# EAGLE design BadUSB-W (EAGLE 9.3.0)

## Sheet 1 of 2
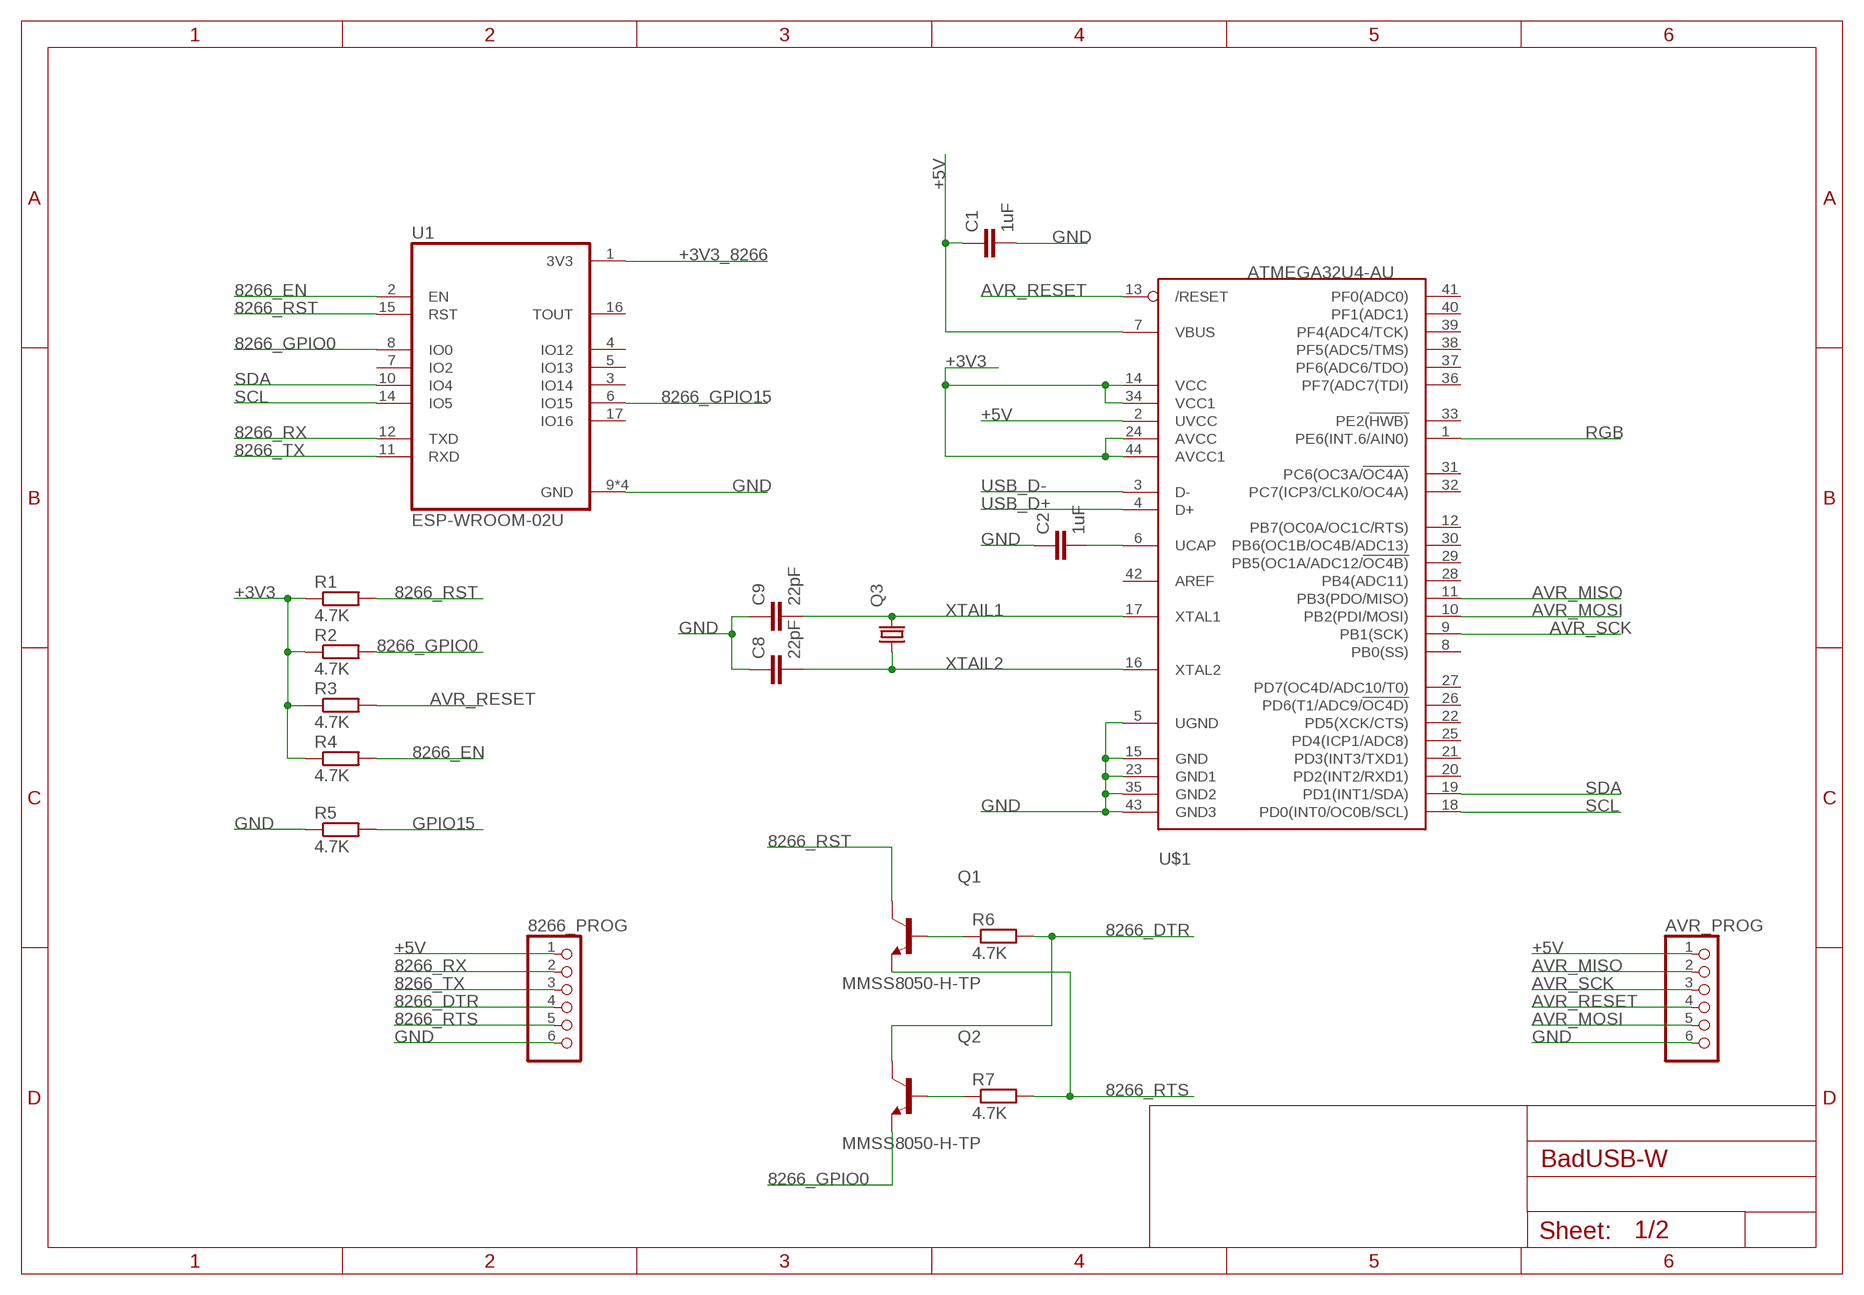
[diagram p0: schematic, sheet 1]

### Parts
8266_PROG  PINHD-1X6  [1X06]
AVR_PROG  PINHD-1X6  [1X06]
C1  1uF  C-EUC0603K  [C0603K]
C2  1uF  C-EUC0603K  [C0603K]
C8  22pF  C-EUC0603K  [C0603K]
C9  22pF  C-EUC0603K  [C0603K]
Q1  MMSS8050-H-TP  [TRANS_MMSS8050-H-TP]
Q2  MMSS8050-H-TP  [TRANS_MMSS8050-H-TP]
Q3  KX-7  [3.2X2.5_KX-7]
R1  4.7K  R-EU_R0603  [R0603]
R2  4.7K  R-EU_R0603  [R0603]
R3  4.7K  R-EU_R0603  [R0603]
R4  4.7K  R-EU_R0603  [R0603]
R5  4.7K  R-EU_R0603  [R0603]
R6  4.7K  R-EU_R0603  [R0603]
R7  4.7K  R-EU_R0603  [R0603]
U1  ESP-WROOM-02U  [MODULE_ESP-WROOM-02U]
U$1  ATMEGA32U4-AU  [TQFP44]

### Nets
8266_DTR: 8266_PROG.4 Q2.3(C) R6.2
8266_EN: R4.2 U1.2(EN)
8266_GPIO0: Q2.2(E) R2.2 U1.8(IO0)
8266_GPIO15: U1.6(IO15)
8266_RST: Q1.3(C) R1.2 U1.15(RST)
8266_RTS: 8266_PROG.5 Q1.2(E) R7.2
8266_RX: 8266_PROG.2 U1.12(TXD)
8266_TX: 8266_PROG.3 U1.11(RXD)
+3V3: R1.1 R2.1 R3.1 R4.1 U$1.14(VCC) U$1.24(AVCC) U$1.34(VCC1) U$1.44(AVCC1) ; also sheet 2
+3V3_8266: U1.1(3V3)
+5V: 8266_PROG.1 AVR_PROG.1 C1.1 U$1.2(UVCC) U$1.7(VBUS) ; also sheet 2
AVR_MISO: AVR_PROG.2 U$1.11(PB3(PDO/MISO))
AVR_MOSI: AVR_PROG.5 U$1.10(PB2(PDI/MOSI))
AVR_RESET: AVR_PROG.4 R3.2 U$1.13(/RESET)
AVR_SCK: AVR_PROG.3 U$1.9(PB1(SCK))
GND: 8266_PROG.6 AVR_PROG.6 C1.2 C2.1 C8.1 C9.1 R5.1 U1.9(GND) U1.13(GND) U1.18(GND) U1.19(GND) U$1.5(UGND) U$1.15(GND) U$1.23(GND1) U$1.35(GND2) U$1.43(GND3) ; also sheet 2
GPIO15: R5.2
N$1: C2.2 U$1.6(UCAP)
N$2: Q1.1(B) R6.1
N$3: Q2.1(B) R7.1
RGB: U$1.1(PE6(INT.6/AIN0)) ; also sheet 2
SCL: U1.14(IO5) U$1.18(PD0(INT0/OC0B/SCL))
SDA: U1.10(IO4) U$1.19(PD1(INT1/SDA))
USB_D+: U$1.4(D+) ; also sheet 2
USB_D-: U$1.3(D-) ; also sheet 2
XTAIL1: C9.2 Q3.3 U$1.17(XTAL1)
XTAIL2: C8.2 Q3.1 U$1.16(XTAL2)
Unconnected: U1.3(IO14) U1.4(IO12) U1.5(IO13) U1.7(IO2) U1.16(TOUT) U1.17(IO16) U$1.8(PB0(SS)) U$1.12(PB7(OC0A/OC1C/RTS)) U$1.20(PD2(INT2/RXD1)) U$1.21(PD3(INT3/TXD1)) U$1.22(PD5(XCK/CTS)) U$1.25(PD4(ICP1/ADC8)) U$1.26(PD6(T1/ADC9/!OC4D)) U$1.27(PD7(OC4D/ADC10/T0)) U$1.28(PB4(ADC11)) U$1.29(PB5(OC1A/ADC12/!OC4B)) U$1.30(PB6(OC1B/OC4B/ADC13)) U$1.31(PC6(OC3A/!OC4A)) U$1.32(PC7(ICP3/CLK0/OC4A)) U$1.33(PE2(!HWB)) U$1.36(PF7(ADC7(TDI)) U$1.37(PF6(ADC6/TDO)) U$1.38(PF5(ADC5/TMS)) U$1.39(PF4(ADC4/TCK)) U$1.40(PF1(ADC1)) U$1.41(PF0(ADC0)) U$1.42(AREF)

## Sheet 2 of 2
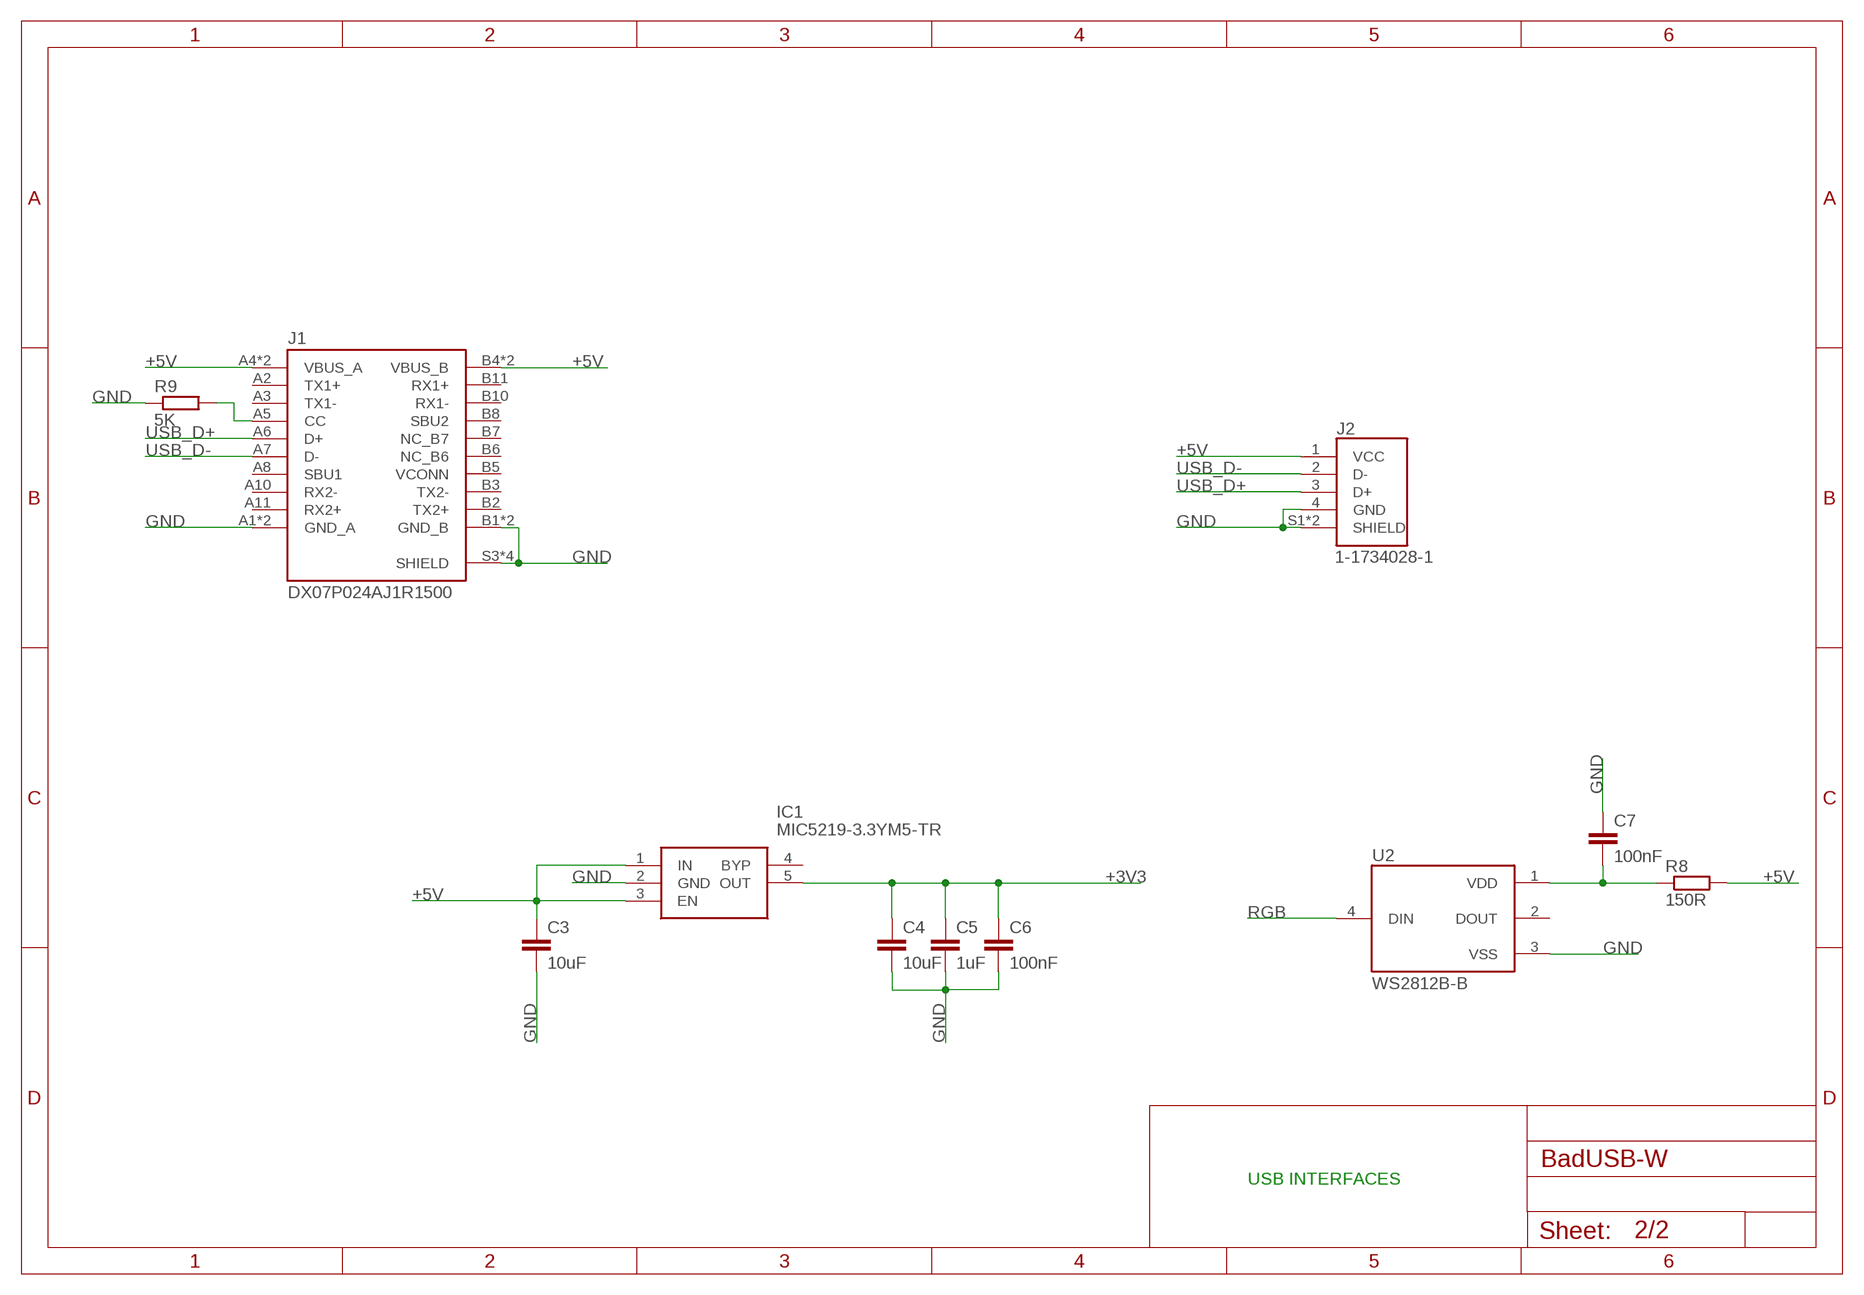
[diagram p1: schematic, sheet 2]

### Parts
C3  10uF  C-EUC0603K  [C0603K]
C4  10uF  C-EUC0603K  [C0603K]
C5  1uF  C-EUC0603K  [C0603K]
C6  100nF  C-EUC0603K  [C0603K]
C7  100nF  C-EUC0603K  [C0603K]
IC1  MIC5219-3.3YM5-TR  [SOT95P280X130-5N]
J1  DX07P024AJ1R1500  [JAE_DX07P024AJ1R1500]
J2  1-1734028-1  [TE_1-1734028-1]
R8  150R  R-EU_R0603  [R0603]
R9  5K  R-EU_R0603  [R0603]
U2  WS2812B-B  [LED_WS2812B-B]

### Nets
+3V3: C4.1 C5.1 C6.1 IC1.5(OUT) ; also sheet 1
+5V: C3.1 IC1.1(IN) IC1.3(EN) J1.A4(VBUS_A) J1.A9(VBUS_A) J1.B4(VBUS_B) J1.B9(VBUS_B) J2.1(VCC) R8.2 ; also sheet 1
GND: C3.2 C4.2 C5.2 C6.2 C7.1 IC1.2(GND) J1.A1(GND_A) J1.A12(GND_A) J1.B1(GND_B) J1.B12(GND_B) J1.S3(SHIELD) J1.S4(SHIELD) J1.S5(SHIELD) J1.S6(SHIELD) J2.4(GND) J2.S1(SHIELD) J2.S2(SHIELD) R9.1 U2.3(VSS) ; also sheet 1
N$4: C7.2 R8.1 U2.1(VDD)
N$5: J1.A5(CC) R9.2
RGB: U2.4(DIN) ; also sheet 1
USB_D+: J1.A6(D+) J2.3(D+) ; also sheet 1
USB_D-: J1.A7(D-) J2.2(D-) ; also sheet 1
Unconnected: IC1.4(BYP) J1.A2(TX1+) J1.A3(TX1-) J1.A8(SBU1) J1.A10(RX2-) J1.A11(RX2+) J1.B2(TX2+) J1.B3(TX2-) J1.B5(VCONN) J1.B6(NC_B6) J1.B7(NC_B7) J1.B8(SBU2) J1.B10(RX1-) J1.B11(RX1+) U2.2(DOUT)

### Notes on the sheet
- USB INTERFACES

## Library data of the parts
8266_PROG AVR_PROG = adafruit:PINHD-1X6: PIN HEADER
C1-C9 = rcl:C-EU: CAPACITOR, European symbol; SPICEPREFIX: C
IC1 = MIC5219-3.3YM5-TR:MIC5219-3.3YM5-TR: LDO Regulator Pos 3.3V 0.5A Microchip MIC5219-3.3YM5-TR, LDO Voltage Regulator, 500mA, 3.3 V +/-2%, 2.5 12 Vin, 5-Pin SOT-23 Source: Datasheet <http://www.microchip.com/mymicrochip/filehandler.aspx?ddocname=en579712>; ARROW_PART_NUMBER: MIC5219-3.3YM5-TR; ARROW_PRICE-STOCK: https://www.arrow.com/en/products/mic5219-3.3ym5-tr/microchip-technology; DESCRIPTION: LDO Regulator Pos 3.3V 0.5A Microchip MIC5219-3.3YM5-TR, LDO Voltage Regulator, 500mA, 3.3 V +/-2%, 2.5 12 Vin, 5-Pin SOT-23; HEIGHT: 1.3mm; MANUFACTURER_NAME: Microchip; MANUFACTURER_PART_NUMBER: MIC5219-3.3YM5-TR; MOUSER_PART_NUMBER: 998-MIC5219-3.3YM5TR; MOUSER_PRICE-STOCK: https://www.mouser.co.uk/ProductDetail/Microchip-Technology-Micrel/MIC5219-33YM5-TR/?qs=U6T8BxXiZAWojkIJMtSJlw%3D%3D
J1 = DX07P024AJ1R1500:DX07P024AJ1R1500: USB-C (USB TYPE-C) USB 3.2 Gen 2 (USB 3.1 Gen 2, Superspeed + (USB 3.1)) Plug Connector 24 Position Board Edge, Straddle Mount Check prices <https://pricing.snapeda.com/parts/DX07P024AJ1R1500/JAE%20Electronics/view-part?ref=eda>; AVAILABILITY: In Stock; DESCRIPTION: USB-C (USB TYPE-C) USB 3.2 Gen 2 (USB 3.1 Gen 2, Superspeed + (USB 3.1)) Plug Connector 24 Position Board Edge, Straddle Mount; MF: JAE Electronics; MP: DX07P024AJ1R1500; PACKAGE: None; PRICE: None
J2 = 1-1734028-1:1-1734028-1: Conn USB 2.0 Type A PL 4 POS Solder RA SMD 4 Terminal 1 Port T/R Check prices <https://pricing.snapeda.com/parts/1-1734028-1/TE%20Connectivity/view-part?ref=eda>; AVAILABILITY: In Stock; COMMENT: 1-1734028-1; DESCRIPTION: Conn USB 2.0 Type A PL 4 POS Solder RA SMD 4 Terminal 1 Port T/R; MF: TE Connectivity; MP: 1-1734028-1; PACKAGE: None; PRICE: None
Q1 Q2 = MMSS8050-H-TP:MMSS8050-H-TP: MMSS8050-H Series 25 V 1.5 A NPN Silicon Plastic-Encapsulate Transistor-SOT-23 Check prices <https://pricing.snapeda.com/parts/MMSS8050-H-TP/Micro%20Commercial/view-part?ref=eda>; AVAILABILITY: In Stock; DESCRIPTION: Bipolar (BJT) Transistor NPN 25V 1.5A 100MHz 625mW Surface Mount SOT-23; MF: Micro Commercial; MP: MMSS8050-H-TP; PACKAGE: SOT-23 MCC; PRICE: None
Q3 = crystal-geyer_V1_0:KX: Quartz Crystals (MHz) SMD: KX - Serie Model Size l/w/h [mm] Frequency Range Frequency Stability Temp. Range [°C] Load Capacitance AECQ 200 availabel Datasheet KX-4 KX-5 KX-6 KX-7 KX-9A KX-9B KX-12A KX-12B KX-13 KX-20 KX-K KX-KS 1.6/1.2/0.3 2.0/1.6/0.45 2.5/2.0/0.55 3.2/2.5/0.8 5.0/3.2/1.0 5.0/3.2/1.1 6.0/3.5/1.1 6.0/3.5/1.0 7.0/5.0 /1.3 11.6/5.5/1.6 12.3/4.5/4.2 12.3/4.5/3.2 24.0 ~ 80.0 MHz 16.0 ~ 80.0 MHz 12.0 ~ 80.0 MHz 8.0 ~ 60.0 MHz 7,68 ~ 300,0 MHz 8,0 ~ 50,0 MHz 8,0 ~ 150,0 MHz 8,0 ~ 50,0 MHz 6,0 ~ 160,0 MHz 3,579 ~ 25,0 MHz 3,579 ~ 70,0 MHz 3,579 ~ 70,0 MHz ±10 … ±50ppm ±10 … ±50ppm ±10 … ±50ppm ±10 … ±50ppm ±10 … ±50ppm ±10 … ±50ppm ±10 … ±50ppm ±10 … ±50ppm ±10 … ±50ppm ±50ppm ±10 … ±50ppm ±10 … ±50ppm (*) -40°C …+85°C (*) -40°C …+125°C (*) -40°C …+125°C (*) -40°C …+125°C (*) -40°C …+105°C (*) -40°C …+105°C (*) -40°C …+125°C (*) -40°C …+105°C (*) -40°C …+105°C (*) -40°C …+105°C (*) -40°C …+85°C (*) -40°C …+85°C 8, 8…16 8, 8…16 10, 8…16 12, 7…20 16, 10…20 16, 10…20 16, 10…20 16, 12…20 16, 12…20 16, 12…20 16, 12…30 16, 12…30 - yes yes yes - - - - - - - - KX-4.pdf <http://www.geyer-electronic.de/uploads/tx_userartikelfrequenz/GEYER-KX-4.pdf> KX-5.pdf <http://www.geyer-electronic.de/uploads/tx_userartikelfrequenz/GEYER-KX-5.pdf> KX-6.pdf <http://www.geyer-electronic.de/uploads/tx_userartikelfrequenz/GEYER-KX-6.pdf> KX-7.pdf <http://www.geyer-electronic.de/uploads/tx_userartikelfrequenz/GEYER-KX-7.pdf> KX-9A.pdf <http://www.geyer-electronic.de/uploads/tx_userartikelfrequenz/GEYER-KX-9A.pdf> KX-9B.pdf <http://www.geyer-electronic.de/uploads/tx_userartikelfrequenz/GEYER-KX-9B.pdf> KX-12A.pdf <http://www.geyer-electronic.de/uploads/tx_userartikelfrequenz/GEYER-KX-12A.pdf> KX-12B.pdf <http://www.geyer-electronic.de/uploads/tx_userartikelfrequenz/GEYER-KX-12B.pdf> KX-13.pdf <http://www.geyer-electronic.de/uploads/tx_userartikelfrequenz/GEYER-KX-13.pdf> KX-20.pdf <http://www.geyer-electronic.de/uploads/tx_userartikelfrequenz/GEYER-KX-20.pdf> KX-K.pdf <http://www.geyer-electronic.de/uploads/tx_userartikelfrequenz/GEYER-KX-K.pdf> KX-KS.pdf <http://www.geyer-electronic.de/uploads/tx_userartikelfrequenz/GEYER-KX-KS.pdf> <http://www.geyer-electronic.de/fileadmin/template/img/logo-geyer-electronic.png> Details see: http://www.geyer-electronic.de/Frequenz-Produkte.9.0.html Created 2016-06-07, Hans Locher 2016 (C) Geyer Quartz Technology KX4,KX5,KX6,KX7,KX9A,KX9B,KX12A,KX12B,KX13,KX20,KXK,KXKS;1612;2016;2520;3225;5032;6035;7050;11655;12345;1,6x1,2;2,0x1,6;2,5x2,0;3,2x2,5;5,0x3,2;6,0x3,5;7,0x5,0;11,6x5,5;12,3x4,5;12,3x4,5;1.6x1.2;2.0x1.6;2.5x2.0;3.2x2.5;5.0x3.2;6.0x3.5;7.0x5.0;11.6x5.5;12.3x4.5;12.3x4.5;
R1-R9 = rcl:R-EU_: RESISTOR, European symbol; SPICEPREFIX: R
U1 = ESP-WROOM-02U:ESP-WROOM-02U: Module: WiFi; GPIO, I2C, I2S, PWM, SDIO, SPI, UART; U.FL; 2.7÷3.6VDC Check prices <https://pricing.snapeda.com/parts/ESP-WROOM-02U/Espressif%20Systems/view-part?ref=eda>; AVAILABILITY: No availability data; DESCRIPTION: WiFi 802.11b/g/n Transceiver Module 2.4GHz ~ 2.5GHz Integrated, Chip + IPEX Surface Mount; MF: Espressif Systems; MP: ESP-WROOM-02U; PACKAGE: SMD-18 Espressif Systems; PRICE: None
U2 = WS2812B-B:WS2812B-B: Intelligent control LED integrated light source Check prices <https://pricing.snapeda.com/parts/WS2812B-B/Worldsemi/view-part?ref=eda>; AVAILABILITY: No availability data; DESCRIPTION: Intelligent control LED integrated light source; MF: Worldsemi; MP: WS2812B-B; PACKAGE: Package; PRICE: None
U$1 = adafruit:ATMEGA32U4: http://www.ladyada.net/library/eagle

## Board
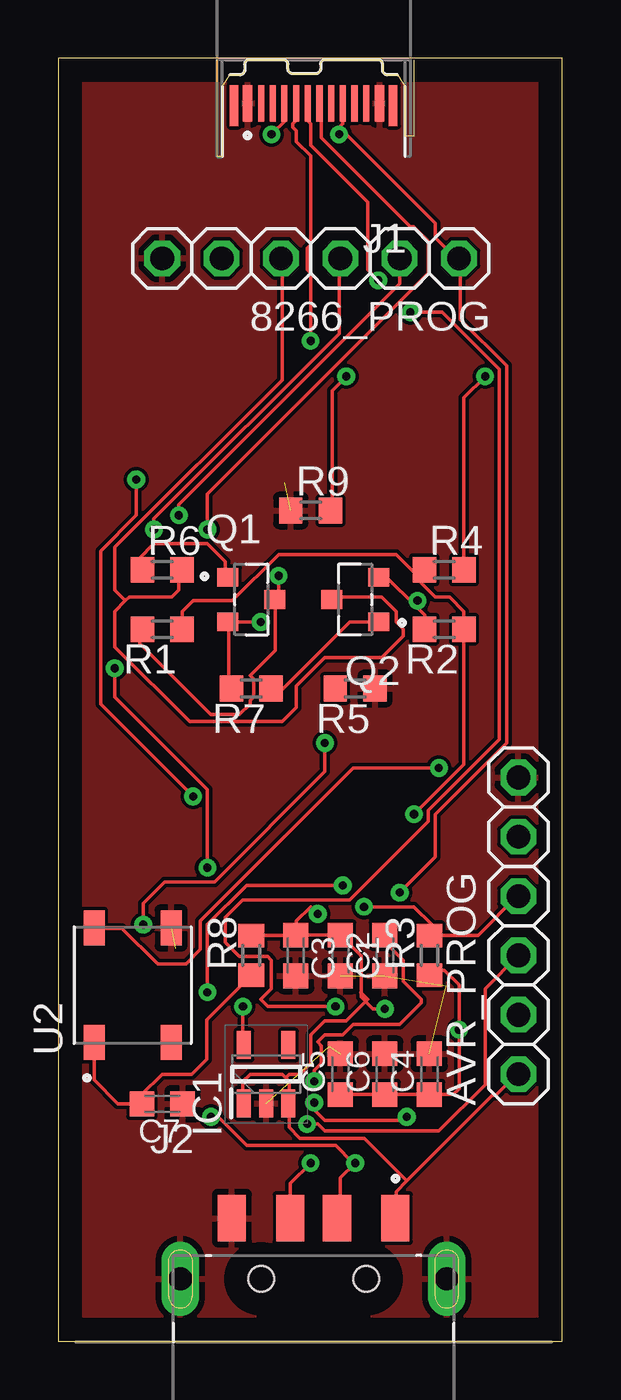
[diagram p2: board, top side]
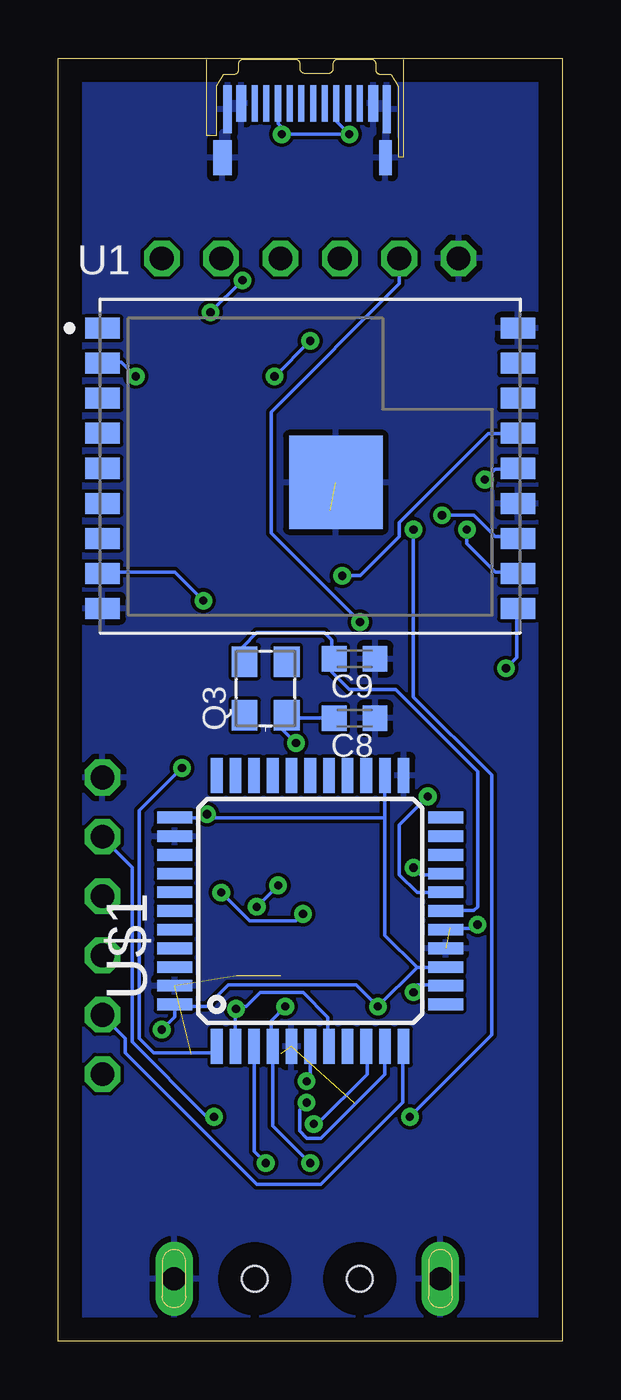
[diagram p3: board, bottom side, seen from below]

Size 21.57 x 54.91 mm. Coordinates in mm from the lower left corner, seen from the top.
Outline: 0,0 21.57,0 21.57,54.91 0,54.91 0,0
Copper layers (1*16): Top 0.035mm / dielectric 1.5mm / Bottom 0.035mm
Design rules "default": minimum track width 6mil, minimum drill 0.35mm, track to track 6mil, track to pad 6mil, pad to pad 6mil, via to via 6mil, smd to smd 6mil, copper to edge 40mil, drill to drill 6mil, minimum pad ring 10mil, minimum via ring 8mil, stop-mask expansion 4mil, vias tented up to drill 0mil, thermal gap 10mil

### Footprints (pad centres in the part's own frame; a part is rotated, then mirrored left to right if it is on the bottom)
1X06 = drill 1.016 octagon: 1 -6.35,0; 2 -3.81,0; 3 -1.27,0; 4 1.27,0; 5 3.81,0; 6 6.35,0
C0603K = smd 1.05 x 1.08: 1 -0.875,0; 2 0.875,0
SOT95P280X130-5N = smd 1.2 x 0.6: 1 -1.25,0.95; 2 -1.25,0; 3 -1.25,-0.95; 4 1.25,-0.95; 5 1.25,0.95
JAE_DX07P024AJ1R1500 = smd 0.41 x 1.55: A1 2.825,1.875; A12 -2.825,1.875 | smd 0.26 x 1.55: A2 2.25,1.875; A3 1.75,1.875; A4 1.25,1.875; A5 0.75,1.875; A6 0.25,1.875; A7 -0.25,1.875; A8 -0.75,1.875; A9 -1.25,1.875; A10 -1.75,1.875; A11 -2.25,1.875 | smd 0.41 x 1.55 bottom: B1 -2.825,1.875; B12 2.825,1.875 | smd 0.26 x 1.55 bottom: B2 -2.25,1.875; B3 -1.75,1.875; B4 -1.25,1.875; B5 -0.75,1.875; B6 -0.25,1.875; B7 0.25,1.875; B8 0.75,1.875; B9 1.25,1.875; B10 1.75,1.875; B11 2.25,1.875 | smd 0.36 x 1.75: S1 -3.405,1.975; S2 3.405,1.975 | smd 0.36 x 2.05 bottom: S3 -3.405,2.125; S4 3.405,2.125 | smd 0.785 x 1.5 bottom: S5 -3.632,4.2 | smd 0.55 x 1.5 bottom: S6 3.35,4.2
TE_1-1734028-1 = smd 1.2 x 2: 1 3.5,2.6; 2 1,2.6; 3 -1,2.6; 4 -3.5,2.6 | drill 1 pad 1.6 long: S1 -5.7,0; S2 5.7,0 | hole 1.1: -2.25,0; 2.25,0
TRANS_MMSS8050-H-TP = smd 0.9 x 0.8: 1 -1,0.95; 2 -1,-0.95; 3 1,0
3.2X2.5_KX-7 = smd 1.3 x 1.1: 1 -1.15,-0.9; 2 1.15,-0.9; 3 1.15,0.9; 4 -1.15,0.9
R0603 = smd 1 x 1.1: 1 -0.85,0; 2 0.85,0
MODULE_ESP-WROOM-02U = smd 1.485 x 0.9: 1 -8.893,5.9; 2 -8.893,4.4; 3 -8.893,2.9; 4 -8.893,1.4; 5 -8.893,-0.1; 6 -8.893,-1.6; 7 -8.893,-3.1; 8 -8.893,-4.6; 9 -8.893,-6.1; 10 8.893,-6.1; 11 8.893,-4.6; 12 8.893,-3.1; 13 8.893,-1.6; 14 8.893,-0.1; 15 8.893,1.4; 16 8.893,2.9; 17 8.893,4.4; 18 8.893,5.9 | smd 4 x 4: 19 1.1,-0.7
LED_WS2812B-B = smd 1.5 x 0.9: 1 -2.45,1.65; 2 -2.45,-1.65; 3 2.45,-1.65; 4 2.45,1.65
TQFP44 = smd 1.5 x 0.5: 1 -5.8,4; 2 -5.8,3.2; 3 -5.8,2.4; 4 -5.8,1.6; 5 -5.8,0.8; 6 -5.8,0; 7 -5.8,-0.8; 8 -5.8,-1.6; 9 -5.8,-2.4; 10 -5.8,-3.2; 11 -5.8,-4; 23 5.8,-4; 24 5.8,-3.2; 25 5.8,-2.4; 26 5.8,-1.6; 27 5.8,-0.8; 28 5.8,0; 29 5.8,0.8; 30 5.8,1.6; 31 5.8,2.4; 32 5.8,3.2; 33 5.8,4 | smd 0.5 x 1.5: 12 -4,-5.8; 13 -3.2,-5.8; 14 -2.4,-5.8; 15 -1.6,-5.8; 16 -0.8,-5.8; 17 0,-5.8; 18 0.8,-5.8; 19 1.6,-5.8; 20 2.4,-5.8; 21 3.2,-5.8; 22 4,-5.8; 34 4,5.8; 35 3.2,5.8; 36 2.4,5.8; 37 1.6,5.8; 38 0.8,5.8; 39 0,5.8; 40 -0.8,5.8; 41 -1.6,5.8; 42 -2.4,5.8; 43 -3.2,5.8; 44 -4,5.8

### Placement (x,y rotation side)
8266_PROG  10.79,46.35 180 top
AVR_PROG  19.68,17.78 90 top
C1  12.06,16.51 270 top
C2  13.97,16.51 90 top
C3  10.16,16.51 270 top
C4  15.88,11.43 90 top
C5  12.06,11.43 90 top
C6  13.97,11.43 90 top
C7  4.45,10.16 180 top
C8  8.89,26.67 180 bottom
C9  8.89,29.21 180 bottom
IC1  8.89,11.43 90 top
J1  10.92,54.86 180 top
J2  10.92,2.67 0 top
Q1  8.26,31.75 0 top
Q2  12.7,31.75 180 top
Q3  12.7,27.94 90 bottom
R1  4.45,30.48 180 top
R2  16.51,30.48 180 top
R3  15.88,16.51 90 top
R4  16.51,33.02 0 top
R5  12.7,27.94 180 top
R6  4.45,33.02 0 top
R7  8.26,27.94 180 top
R8  8.26,16.51 90 top
R9  10.79,35.56 0 top
U1  10.79,37.47 0 bottom
U2  3.17,15.24 90 top
U$1  10.79,18.41 90 bottom

### Tracks (layer width: path | path; a pad name or v marks a point on that pad's centre or on a via)
8266_DTR
  Top 0.152: 2.87,31.7 3.02,31.85 4.85,31.85 5.16,32.16 5.16,32.92 R6.2 | 2.87,31.7 2.41,31.24 2.41,29.72 5.61,26.52 9.58,26.52 10.19,27.13 10.19,28.04 11.4,29.26 13.84,29.26 14.76,30.18 14.76,30.48 14.45,30.79 14.45,31.24 13.84,31.85 11.71,31.85 Q2.3 | 2.87,31.7 2.41,32.16 2.41,33.98 9.58,41.15 9.58,46.33 8266_PROG.4
8266_EN  (via drill 0.35)
  Top 0.152: v18.26,41.3 17.35,40.39 17.35,33.07 R4.2
  Bottom 0.152: v18.26,41.3 18.87,41.91 19.63,41.91 U1.2
8266_GPIO0  (via drill 0.35)
  Top 0.152: 15.21,31.55 15.67,31.09 15.67,30.48 R2.2 | 15.21,31.55 14.15,32.61 13.84,32.61 Q2.2 | 15.21,31.55 v15.37,31.7
  Bottom 0.152: v15.37,31.7 16.59,32.92 19.63,32.92 U1.8
8266_RST  (via drill 0.35)
  Top 0.152: R1.2 3.48,30.48 3.48,29.87 6.53,26.82 7.75,26.82 8.2,27.28 8.2,27.43 8.36,27.58 8.36,28.35 8.2,28.5 9.27,29.57 9.27,31.7 Q1.3 9.27,31.85 9.42,32 v9.42,32.77
  Bottom 0.152: v9.42,32.77 8.66,32.77 6.99,34.44 6.99,35.05 3.17,38.86 1.96,38.86 U1.15
8266_RTS  (via drill 0.35)
  Top 0.152: 7.29,30.79 7.29,28.04 R7.2 | v8.66,30.79 7.29,30.79 | 7.29,30.79 Q1.2
  Bottom 0.152: v8.66,30.79 12.47,34.59 12.47,39.78 6.99,45.26 8266_PROG.5
8266_RX  (via drill 0.35)
  Top 0.152: v5.16,35.36 5.16,35.81 14.61,45.26 8266_PROG.2
  Bottom 0.152: v5.16,35.36 3.79,35.36 2.87,34.44 1.96,34.44 U1.12
8266_TX  (via drill 0.35)
  Top 0.152: v4.09,34.75 4.09,35.2 12.01,43.13 12.01,46.33 8266_PROG.3
  Bottom 0.152: v4.09,34.75 4.09,34.14 2.87,32.92 1.96,32.92 U1.11
+3V3  (via drill 0.35)
  Top 0.152: C5.1 C6.1 C4.1 16.9,10.55 17.14,10.79 v17.14,13.34 17.14,15.24 16.51,15.88 16.09,15.88 R3.1 | 15.52,32.92 15.21,32.92 14.45,33.68 9.42,33.68 7.44,31.7 5.77,31.7 5.31,31.24 5.31,30.48 R1.1 | 17.35,30.48 17.35,31.24 16.74,31.85 16.13,31.85 15.52,32.46 15.52,32.92 | 15.52,32.92 R4.1 | v7.9,14.33 7.9,12.8 IC1.5 | 17.35,30.48 17.35,24.69 v15.21,22.55 | 17.35,30.48 R2.1
  Bottom 0.152: v17.14,13.34 16.59,13.88 U$1.44 16.59,14.33 15.21,14.33 14.3,15.24 8.81,15.24 v7.9,14.33 6.22,16 | 6.22,16 5,16 U$1.14 | 7.6,22.4 7.6,17.37 6.22,16 | 7.6,22.4 7.6,24.08 U$1.24 | 7.6,22.4 15.21,22.4 | 15.21,22.4 U$1.34 | 15.21,22.4 v15.21,22.55
+5V  (via drill 0.35)
  Top 0.152: C3.1 C1.1 12.95,16.5 12.95,14.94 | C3.1 10.13,17.36 R8.2 | 12.95,14.94 12.95,14.73 13.46,14.22 v13.97,14.22 | v9.12,51.66 9.73,52.27 9.73,52.88 J1.B9 | 12.32,51.66 16.13,47.85 16.13,47.24 17.04,46.33 8266_PROG.1 17.2,46.33 17.2,43.74 19.18,41.76 19.18,25.6 16.13,22.55 16.13,20.73 v14.61,19.2 | 12.32,51.66 12.01,51.97 12.17,52.12 12.17,52.88 J1.B4 | 12.32,51.66 v12.01,51.66 | 9.73,11.28 9.88,11.12 9.88,10.21 IC1.3 9.88,10.06 9.88,9.14 10.34,8.69 13.08,8.69 14.91,6.86 | 9.73,11.28 9.58,11.43 8.2,11.43 7.9,11.12 7.9,10.21 IC1.1 | 9.73,11.28 9.88,11.43 10.34,11.43 10.79,11.89 10.79,13.11 11.4,13.72 12.32,13.72 13.23,14.63 12.93,14.94 12.95,14.94 | 14.91,6.86 18.57,10.52 18.72,10.52 19.63,11.43 AVR_PROG.1 | 14.91,6.86 14.45,6.4 14.45,5.33 J2.1 | v11.1,18.29 10.79,18.59 10.19,17.98 10.19,17.53 C3.1
  Bottom 0.152: U$1.2 14,14.2 v13.97,14.22 13.84,14.33 13.54,14.33 12.93,14.94 11.1,14.94 10.03,13.87 10.03,12.65 U$1.7 | 9.27,51.82 9.73,52.27 9.73,52.88 J1.B9 | 9.27,51.82 9.42,51.66 v12.01,51.66 12.17,51.82 12.01,51.97 12.17,52.12 12.17,52.88 J1.B4 | 9.27,51.82 v9.12,51.66 | v14.61,19.2 13.39,17.98 11.4,17.98 v11.1,18.29
AVR_MISO
  Bottom 0.152: U$1.11 6.83,12.5 6.83,10.21 10.34,6.71 13.08,6.71 18.72,12.34 18.72,12.95 19.63,13.87 AVR_PROG.2
AVR_MOSI  (via drill 0.35)
  Top 0.152: v10.95,10.21 10.95,9.91 11.4,9.45 14.76,9.45 v14.91,9.6
  Bottom 0.152: v10.95,10.21 11.25,9.91 11.25,8.99 10.95,8.69 10.34,8.69 7.6,11.43 7.6,12.5 U$1.10 | v14.91,9.6 15.21,9.6 18.41,12.8 18.41,20.27 19.63,21.49 AVR_PROG.5
AVR_RESET  (via drill 0.35)
  Top 0.152: 15.98,17.37 17.96,17.37 19.63,19.05 AVR_PROG.4 | v6.38,14.94 6.38,17.83 8.05,19.51 v12.17,19.51 | v13.08,18.59 15.21,18.59 15.98,17.83 15.98,17.37 | 15.98,17.37 R3.2
  Bottom 0.152: v6.38,14.94 6.38,15.09 6.22,15.24 5,15.24 U$1.13 | v13.08,18.59 v12.17,19.51
AVR_SCK  (via drill 0.35)
  Top 0.152: v10.64,9.3 11.1,9.3 11.4,8.99 16.28,8.99 18.26,10.97 18.26,15.09 AVR_PROG.3
  Bottom 0.152: v10.64,9.3 10.49,9.3 8.36,11.43 8.36,12.5 U$1.9
GND  (7 unrouted)
  pour Top: 0,54.86 21.59,54.86 21.59,0 0,0
  pour Bottom: 0,54.86 21.59,54.86 21.59,0 0,0
N$1  (via drill 0.35)
  Top 0.152: v10.95,11.12 10.95,11.58 11.25,11.89 11.25,12.65 11.1,12.8 11.4,13.11 12.17,13.11 12.62,13.56 14.61,13.56 15.52,14.48 15.52,14.63 14.76,15.39 14.76,16.31 14,17.07 14,17.37 C2.2
  Bottom 0.152: v10.95,11.12 10.95,11.28 10.79,11.43 U$1.6
N$2
  Top 0.152: Q1.1 7.14,32.77 7.14,33.38 6.38,34.14 4.09,34.14 3.48,33.53 3.48,33.07 R6.1
N$3
  Top 0.152: Q2.1 13.69,30.79 12.47,30.79 9.58,27.89 9.12,27.89 R7.1
N$4
  Top 0.152: 7.84,15.24 R8.1 6.35,13.76 6.35,12.06 5.71,11.43 4.45,11.43 3.57,10.55 C7.2 2.54,10.16 1.53,11.18 U2.1
N$5  (via drill 0.35)
  Top 0.152: v12.32,41.3 11.71,40.69 11.71,35.66 R9.2 | v10.79,42.82 10.79,45.72 10.64,45.87 10.64,46.79 10.79,46.94 10.79,50.75 10.19,51.36 10.19,51.82 10.03,51.97 10.03,52.12 10.19,52.27 10.19,52.88 J1.A5
  Bottom 0.152: v10.79,42.82 v12.32,41.3
RGB  (via drill 0.35)
  Top 0.152: v16.28,24.54 12.62,24.54 6.07,17.98 6.07,16.76 5.46,16.15 4.24,16.15 2.72,17.68 1.65,17.68 U2.4
  Bottom 0.152: v16.28,24.54 18.11,22.71 18.11,12.95 17.5,12.34 14.91,12.34 14.76,12.5 U$1.1
SCL  (via drill 0.35)
  Top 0.152: v3.33,36.88 3.33,35.36 1.8,33.83 1.8,27.28 v5.77,23.32
  Bottom 0.152: v3.33,36.88 2.87,37.34 1.96,37.34 U1.14 | v5.77,23.32 6.99,22.1 6.99,19.96 6.22,19.2 U$1.18
SDA  (via drill 0.35)
  Top 0.152: v2.41,28.8 2.41,27.58 6.38,23.62 v6.38,20.27
  Bottom 0.152: v2.41,28.8 1.96,29.26 1.96,31.24 U1.10 | v6.38,20.27 6.07,19.96 5,19.96 U$1.19
USB_D+  (via drill 0.35)
  Top 0.152: J2.3 9.92,6.75 v10.79,7.62 | v13.69,45.41 13.23,45.87 13.23,48.77 10.79,51.21 10.79,52.12 10.64,52.27 10.64,52.88 J1.A6 | v15.06,44.04 16.43,44.04 18.87,41.6 18.87,25.76 15.82,22.71 15.82,22.25 12.47,18.9 7.9,18.9 7.14,18.14 7.14,17.07 7.75,16.46 8.97,16.46 9.12,16.31 9.12,15.09 8.66,14.63 8.97,14.33 v11.86,14.33
  Bottom 0.152: v10.79,7.62 12.39,9.22 U$1.4 12.47,12.65 12.47,13.72 v11.86,14.33 | v15.06,44.04 v13.69,45.41
USB_D-  (via drill 0.35)
  Top 0.152: J2.2 12.06,5.41 12.06,6.99 v12.7,7.62 12.62,7.62 11.86,8.38 8.05,8.38 6.83,9.6 v6.53,9.6 | v6.38,34.75 6.38,36.27 15.82,45.72 15.82,47.09 15.21,47.7 15.06,47.7 11.25,51.51 11.25,52.88 J1.A7
  Bottom 0.152: v12.7,7.62 13.2,8.12 U$1.3 | v6.38,34.75 6.38,27.58 3.02,24.23 3.02,13.11 v6.53,9.6
XTAIL1
  Bottom 0.152: Q3.3 13.69,29.11 13.69,29.72 13.08,30.33 10.19,30.33 9.88,30.02 9.88,29.26 C9.2 9.88,29.11 9.88,28.65 9.12,27.89 7.14,27.89 3.63,24.38 3.63,18.59 3.79,18.44 4.85,18.44 U$1.17
XTAIL2  (via drill 0.35)
  Top 0.152: v3.63,17.83 3.63,18.75 4.55,19.66 6.68,19.66 11.4,24.38 v11.4,25.6
  Bottom 0.152: C8.2 11.71,26.67 Q3.1 11.86,26.67 12.01,26.52 12.01,26.21 v11.4,25.6 | v3.63,17.83 3.79,17.68 4.85,17.68 U$1.16